# Altium schematic sheet Connectors.SchDoc: Connectors
size Letter; DrawnBy: Qinyang Bao, Nicole Rosario; Organization: UW Robotics; Address1: 200 University Avenue; Address2: Waterloo; Address3: Ontario; Address4: Canada N2L 3G6
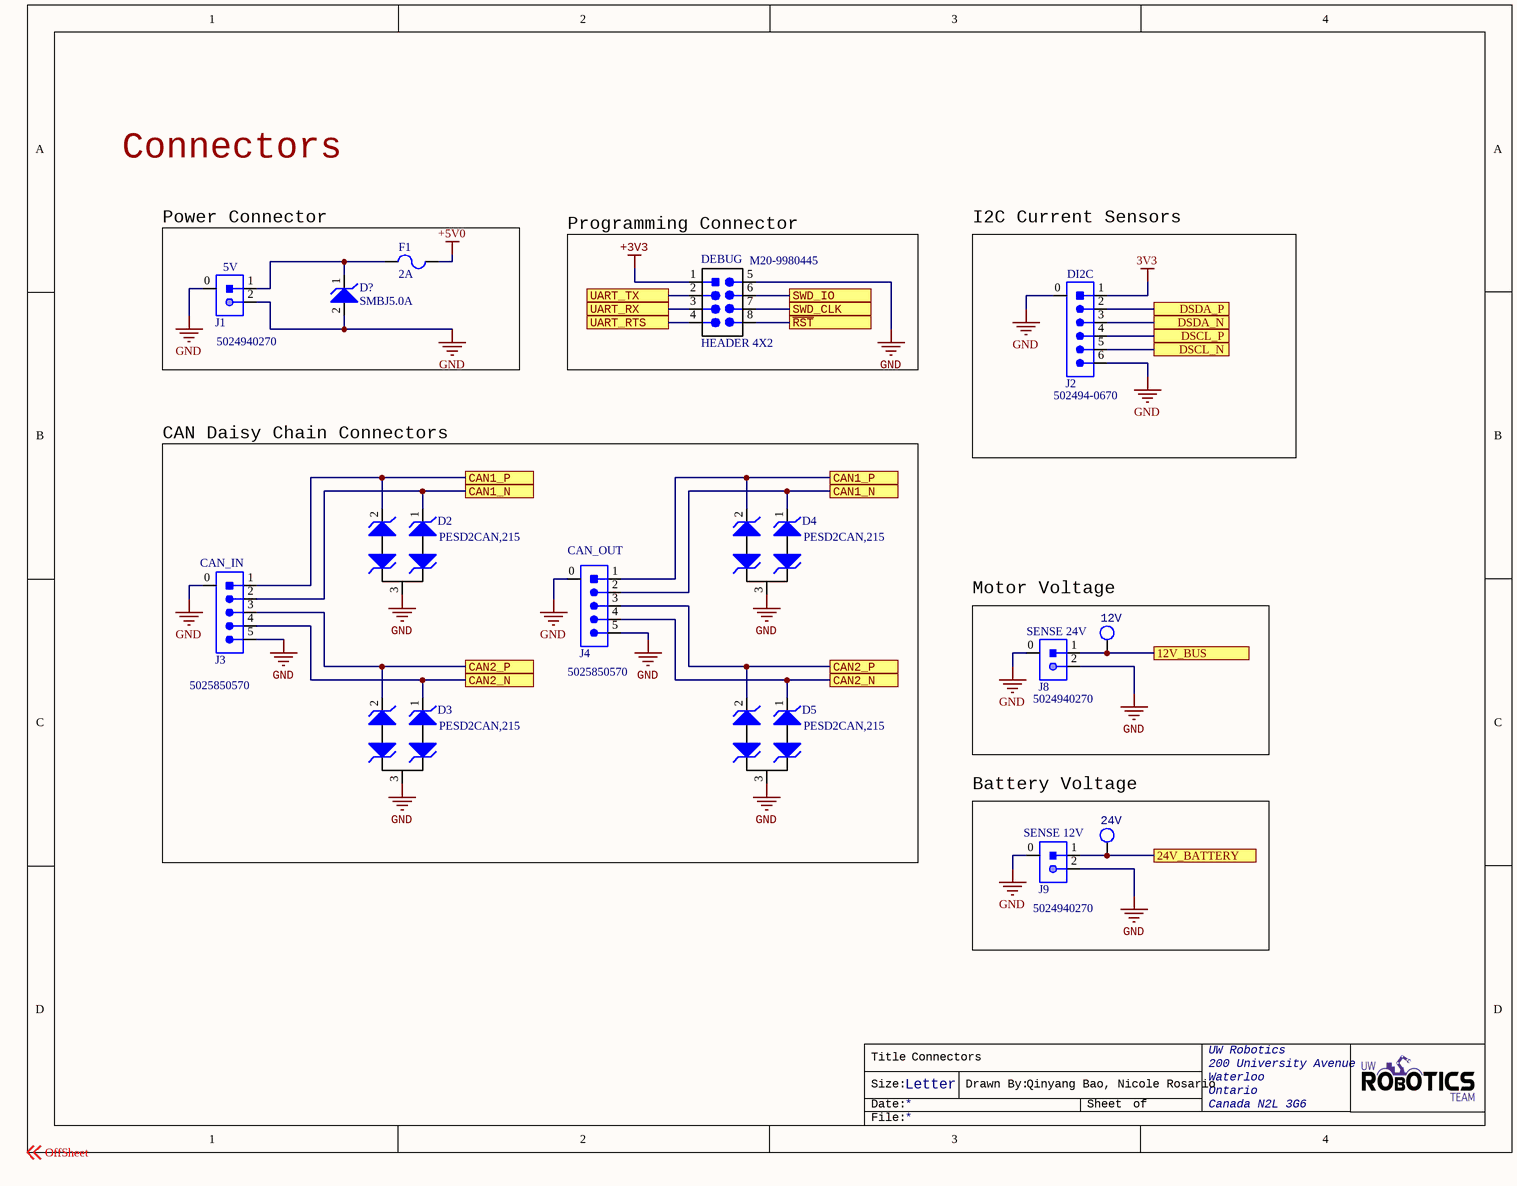
[diagram p0: Connectors.SchDoc]

## Parts
12V  TESTPOINT_LOOP  [TESTPOINT_LOOP]  (value not drawn)
24V  TESTPOINT_LOOP  [TESTPOINT_LOOP]  (value not drawn)
D2  Manufacturer Part Number: PESD2CAN,215  [NXP-SOT323-3]  (hidden comment: TVS_DIODE_CAN)
D3  Manufacturer Part Number: PESD2CAN,215  [NXP-SOT323-3]  (hidden comment: TVS_DIODE_CAN)
D4  Manufacturer Part Number: PESD2CAN,215  [NXP-SOT323-3]  (hidden comment: TVS_DIODE_CAN)
D5  Manufacturer Part Number: PESD2CAN,215  [NXP-SOT323-3]  (hidden comment: TVS_DIODE_CAN)
D?  Manufacturer Part Number 1: SMBJ5.0A  [TVS_DIODE_BIDIRECTIONAL]  (hidden comment: TVS_DIODE_UNIDIR_5V)
DEBUG  HEADER 4X2  Manufacturer Part Number 1: M20-9980445  [HEADER_2X4]
F1  Current Rating: 2A  [FUSE_0603]  (hidden comment: FUSE_2A_0603)
J1  5V  Manufacturer Part Number 1: 5024940270  [MOLEX-5024940270]
J2  DI2C  Manufacturer Part Number 1: 502494-0670  [MOLEX-5024940670]
J3  CAN_IN  Manufacturer Part Number 1: 5025850570  [MOLEX-5025850570]
J4  CAN_OUT  Manufacturer Part Number 1: 5025850570  [MOLEX-5025850570]
J8  SENSE 24V  Manufacturer Part Number 1: 5024940270  [MOLEX-5024940270]
J9  SENSE 12V  Manufacturer Part Number 1: 5024940270  [MOLEX-5024940270]

## Blocks framed on the sheet
Power Connector: D? F1 J1
Programming Connector: DEBUG
I2C Current Sensors: J2
CAN Daisy Chain Connectors: D2-D5 J3 J4
Motor Voltage: 12V J8
Battery Voltage: 24V J9

## Ports
12V_BUS, 24V_BATTERY, CAN1_N, CAN1_P, CAN2_N, CAN2_P, DSCL_N, DSCL_P, DSDA_N, DSDA_P, SWD_CLK, SWD_IO, UART_RTS, UART_RX, UART_TX, ~{RST}

## Nets
3V3: J2.1
+3V3: DEBUG.1(VCC)
+5V0: F1.2
GND: D2.3 D3.3 D4.3 D5.3 D?.2 DEBUG.5(GND) J1.0 J1.2 J2.0 J2.6 J3.0 J3.5 J4.0 J4.5 J8.0 J8.2 J9.0 J9.2
12V_BUS: 12V.1 J8.1 ; port 12V_BUS
24V_BATTERY: 24V.1 J9.1 ; port 24V_BATTERY
~{RST}: DEBUG.8 ; port ~{RST}
CAN1_N: D2.1 D4.1 J3.2 J4.2 ; port CAN1_N
CAN1_P: D2.2 D4.2 J3.1 J4.1 ; port CAN1_P
CAN2_N: D3.1 D5.1 J3.4 J4.4 ; port CAN2_N
CAN2_P: D3.2 D5.2 J3.3 J4.3 ; port CAN2_P
DSCL_N: J2.5 ; port DSCL_N
DSCL_P: J2.4 ; port DSCL_P
DSDA_N: J2.3 ; port DSDA_N
DSDA_P: J2.2 ; port DSDA_P
SWD_CLK: DEBUG.7 ; port SWD_CLK
SWD_IO: DEBUG.6 ; port SWD_IO
UART_RTS: DEBUG.4 ; port UART_RTS
UART_RX: DEBUG.3 ; port UART_RX
UART_TX: DEBUG.2 ; port UART_TX
NetD?_1: D?.1 F1.1 J1.1

## Notes on the sheet
- Connectors
- Labels drawn without touching a wire or pin: OffSheet
- Title
- Size:
- Date:
- Letter
- Drawn By:
- Sheet
- of
- File:

## Library data of the parts
12V 24V = TESTPOINT_LOOP: Loop testpoint through-hole pad; Manufacturer: Keystone Electronics; Manufacturer Part Number 1: 5002; Supplier Part Number 1: 36-5002-ND; Supplier 1: Digi-Key
D2-D5 = TVS_DIODE_CAN: TVS DIODE 24V 41V SOT323-3; Manufacturer: Nexperia USA Inc.; Package: SC-70, SOT-323; ComponentLink1Description: Datasheet; ComponentLink1URL: https://assets.nexperia.com/documents/data-sheet/PESD1CAN-U.pdf; Supplier Part Number 1: 1727-3891-1-ND; Supplier 1: Digi-Key
D? = TVS_DIODE_UNIDIR_5V: TVS DIODE 5V 9.2V DO214AA; Manufacturer 1: Littelfuse; Max Power Dissipation: 600W; Polarity: Unidirectional; Number of Elements: 1; Leakage Current: 800uA; Reverse Breakdown Voltage: 6.4V; Max Surge Current: 65.3A; Max Breakdown Voltage: 7V; Test Current: 10mA; Element Configuration: Single; Power Line Protection: No; Current: 68A; ESD Protection: Yes; ComponentLink1Description: Datasheet; ComponentLink1URL: https://www.littelfuse.com/~/media/electronics/datasheets/tvs_diodes/littelfuse_tvs_diode_smbj_datasheet.pdf.pdf; Supplier 1: Digi-Key; Stock 1: 14825; Pricing 1: 1=0.41000, 10=0.30500, 25=0.27520, 100=0.14500, 250=0.14352, 500=0.12850, 1000=0.10000 (USD); RoHS: Yes; Mount: Surface Mount; Case/Package: SMB; Number of Pins: 2; Min Operating Temperature: -55°C; Max Operating Temperature: 150°C; Packaging: Tape and Reel; Package Quantity: 3000; Power Dissipation: 600W; Direction: Unidirectional; Reverse Standoff Voltage: 5V; Min Breakdown Voltage: 6.4V; Clamping Voltage: 9.2V; Peak Pulse Power: 600W; Breakdown Voltage: 6.4V; Termination: SMD/SMT; Peak Pulse Current: 65.3A; Number of Channels: 1; Max Reverse Leakage Current: 800uA; Operating Supply Voltage: 5V; Number of Unidirectional Channels: 1; Composition: Zener; Voltage Rating (DC): 5V; Voltage: 5V; Length: 0.179inch; Height: 0.096inch; Width: 0.155inch; Radiation Hardening: No; REACH SVHC: Unknown; Lead Free: Lead Free; ComponentLink2URL: https://datasheet.ciiva.com/25624/0900766b810f4eeb-25624712.pdf?src-supplier=RSComponents; ComponentLink2Description: https://datasheet.ciiva.com/25624/0900766b810f4eeb-25624712.pdf?src-supplier=RSComponents; ComponentLink3URL: https://datasheet.ciiva.com/34302/1546929-34302459.pdf?src-supplier=Jameco; ComponentLink3Description: https://datasheet.ciiva.com/34302/1546929-34302459.pdf?src-supplier=Jameco; ComponentLink4URL: https://datasheet.ciiva.com/46381/1677318-46381958.pdf?src-supplier=Element14; ComponentLink4Description: https://datasheet.ciiva.com/46381/1677318-46381958.pdf?src-supplier=Element14; ComponentLink5URL: https://datasheet.ciiva.com/331/littelfuse-tvs-diode-smbj-datasheet-pdf-331131.pdf?src-supplier=Digi-Key; ComponentLink5Description: https://datasheet.ciiva.com/331/littelfuse-tvs-diode-smbj-datasheet-pdf-331131.pdf?src-supplier=Digi-Key; ComponentLink6URL: https://datasheet.ciiva.com/331/littelfuse-tvs-diode-smbj-datasheet-pdf-331132.pdf?src-supplier=Digi-Key; ComponentLink6Description: https://datasheet.ciiva.com/331/littelfuse-tvs-diode-smbj-datasheet-pdf-331132.pdf?src-supplier=Digi-Key; ComponentLink7URL: https://datasheet.ciiva.com/331/littelfuse-tvs-diode-smbj-datasheet-pdf-331133.pdf?src-supplier=Digi-Key; ComponentLink7Description: https://datasheet.ciiva.com/331/littelfuse-tvs-diode-smbj-datasheet-pdf-331133.pdf?src-supplier=Digi-Key; Supplier Part Number 1: SMBJ5.0ALFCT-ND
DEBUG = HEADER 4X2: CONN HEADER VERT 8POS 2.54MM; Manufacturer 1: Harwin Inc.; Supplier Part Number 1: 952-2122-ND; Supplier 1: Digi-Key
F1 = FUSE_2A_0603: FUSE SMD 2A 32V; ComponentLink1URL: https://datasheet.ciiva.com/303/467-303400.pdf?src-supplier=Digi-Key; ComponentLink1Description: https://datasheet.ciiva.com/303/467-303400.pdf?src-supplier=Digi-Key; ComponentLink2URL: http://datasheet.octopart.com/0467002.NRHF-Littelfuse-datasheet-32023482.pdf?src-supplier=Future+Electronics; ComponentLink2Description: http://datasheet.octopart.com/0467002.NRHF-Littelfuse-datasheet-32023482.pdf?src-supplier=Future+Electronics; ComponentLink3URL: http://datasheet.octopart.com/0467002.NRHF-Littelfuse-datasheet-136509808.pdf?src-supplier=Future+Electronics; ComponentLink3Description: http://datasheet.octopart.com/0467002.NRHF-Littelfuse-datasheet-136509808.pdf?src-supplier=Future+Electronics; Mount: Surface Mount; Voltage Rating (AC): 32V; Voltage Rating (DC): 32V; Supplier 1: Digi-Key; Supplier Part Number 1: F7132CT-ND; Supplier Packaging 1: Cut Tape
J1 J8 J9 = CON_2M_SM_RA: CONN HEADER SMD RIGHT ANGLE 2MM PITCH; Manufacturer 1: Molex; Connector Type: Receptacle,Forked; Number of Positions: 2; Supplier 1: Digi-Key; Stock 1: 3397; Pricing 1: 1=0.53000, 10=0.49400, 25=0.44440, 50=0.39500, 100=0.37850, 250=0.34556 (USD); RoHS: No; Mount: Surface Mount; Contact Plating: Tin; Insulation Color: Natural; Insulation Material: Resin; Min Operating Temperature: -40°C; Max Operating Temperature: 105°C; Fastening Type: Latch; Packaging: Tape and Reel; Number of Rows: 1; Termination: Solder; Flammability Rating: UL94 V-0; ComponentLink1URL: https://www.molex.com/pdm_docs/as/AS-502439-002-001.pdf?src-supplier=Digi-Key; ComponentLink1Description: https://www.molex.com/pdm_docs/as/AS-502439-002-001.pdf?src-supplier=Digi-Key; Supplier Part Number 1: WM15810CT-ND
J2 = CON_6M_SM_RA: CONN HEADER SMD RIGHT ANGLE 2MM PITCH; Manufacturer 1: Molex; Insulation Resistance: 1GR; Current Rating: 3A; Voltage Rating: 250V; Connector Type: Receptacle,Forked; Number of Positions: 6; Gender: Receptacle; Glow Wire Compliant: Non-compliant; Supplier 1: Digi-Key; Stock 1: 7093; Pricing 1: 1=0.81000, 10=0.70800, 25=0.66680, 50=0.63880, 100=0.61110, 250=0.55552 (USD); RoHS: Yes; Mount: Surface Mount; Material: Polybutylene; Color: Natural; Housing Material: PBT; Housing Color: Natural; Contact Plating: Tin; Contact Material: Copper Alloy; Min Operating Temperature: -25°C; Max Operating Temperature: 85°C; Package Quantity: 950; Number of Rows: 1; Fastening Type: Latch; Packaging: Tape and Reel; Termination: Solder; Number of Contacts: 6; Orientation: Right Angle; Number of Circuits: 6; Contact Gender: Female; Max Voltage Rating (AC): 250V; Max Voltage Rating (DC): 250V; Length: 16mm; Pitch: 2mm; Depth: 6.85mm; Radiation Hardening: No; REACH SVHC: Unknown; Flammability Rating: UL94 V-0; ComponentLink1URL: https://datasheet.ciiva.com/755/5024940670-sd-755844.pdf?src-supplier=Digi-Key; ComponentLink1Description: https://datasheet.ciiva.com/755/5024940670-sd-755844.pdf?src-supplier=Digi-Key; ComponentLink2URL: https://datasheet.ciiva.com/24467/101355024940670-pcb-receptacles-24467588.pdf?src-supplier=Onlinecomponents.com; ComponentLink2Description: https://datasheet.ciiva.com/24467/101355024940670-pcb-receptacles-24467588.pdf?src-supplier=Onlinecomponents.com; ComponentLink3URL: https://datasheet.ciiva.com/16656/5024940670-pcb-receptacles-16656439.pdf?src-supplier=Avnet+Europe; ComponentLink3Description: https://datasheet.ciiva.com/16656/5024940670-pcb-receptacles-16656439.pdf?src-supplier=Avnet+Europe; ComponentLink4URL: https://datasheet.ciiva.com/7436/1630854-7436283.pdf?src-supplier=Newark; ComponentLink4Description: https://datasheet.ciiva.com/7436/1630854-7436283.pdf?src-supplier=Newark; ComponentLink5URL: https://datasheet.ciiva.com/5157/5024940670-pcb-receptacles-179322-5157180.pdf?src-supplier=Mouser; ComponentLink5Description: https://datasheet.ciiva.com/5157/5024940670-pcb-receptacles-179322-5157180.pdf?src-supplier=Mouser; ComponentLink6URL: https://datasheet.ciiva.com/7917/1630854-7917014.pdf?src-supplier=Element14; ComponentLink6Description: https://datasheet.ciiva.com/7917/1630854-7917014.pdf?src-supplier=Element14; ComponentLink7URL: https://datasheet.ciiva.com/30242/101355024940670-pcb-receptacles-30242550.pdf?src-supplier=Onlinecomponents.com; ComponentLink7Description: https://datasheet.ciiva.com/30242/101355024940670-pcb-receptacles-30242550.pdf?src-supplier=Onlinecomponents.com; ComponentLink8URL: https://datasheet.ciiva.com/755/5024940670-sd-755789.pdf?src-supplier=Digi-Key; ComponentLink8Description: https://datasheet.ciiva.com/755/5024940670-sd-755789.pdf?src-supplier=Digi-Key; Supplier Part Number 1: WM2283CT-ND
J3 J4 = CON_5M_SM_RA: CONN HEADER SMD RIGHT ANGLE 1.5MM PITCH; Manufacturer 1: Molex; Connector Type: Receptacle,Center Strip Contact; Number of Positions: 5; Current Rating: 2A; Supplier 1: Digi-Key; Stock 1: 2875; RoHS: Yes; Mount: Surface Mount; Termination: Solder; Number of Contacts: 5; Orientation: Right Angle; Number of Circuits: 5; Number of Rows: 1; Supplier Part Number 1: WM14469CT-ND